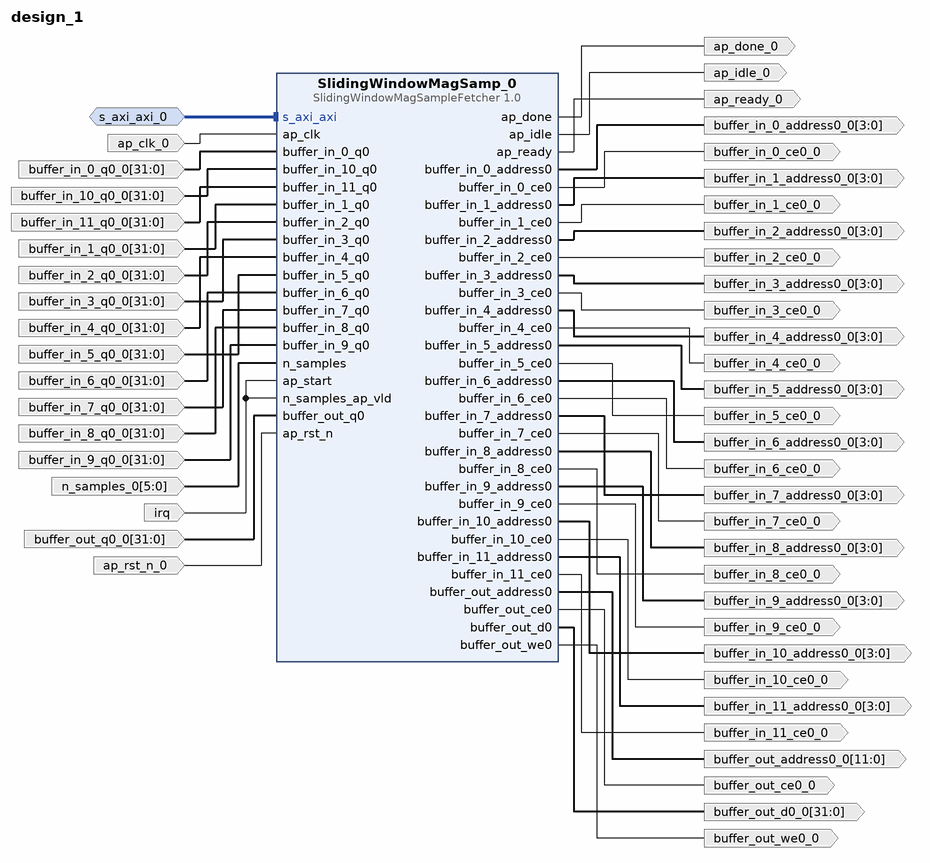
[diagram p0: block diagram of the top level]
# Vivado block design design_1, xczu3eg-sbva484-1-i, Vivado 2020.2
create_bd_design design_1

create_bd_intf_port -mode Slave -vlnv xilinx.com:interface:aximm_rtl:1.0 s_axi_axi_0
set_property -dict [list \
  CONFIG.ADDR_WIDTH 5 \
  CONFIG.ARUSER_WIDTH 0 \
  CONFIG.AWUSER_WIDTH 0 \
  CONFIG.BUSER_WIDTH 0 \
  CONFIG.DATA_WIDTH 32 \
  CONFIG.HAS_BRESP 1 \
  CONFIG.HAS_BURST 0 \
  CONFIG.HAS_CACHE 0 \
  CONFIG.HAS_LOCK 0 \
  CONFIG.HAS_PROT 0 \
  CONFIG.HAS_QOS 0 \
  CONFIG.HAS_REGION 0 \
  CONFIG.HAS_RRESP 1 \
  CONFIG.HAS_WSTRB 1 \
  CONFIG.ID_WIDTH 0 \
  CONFIG.MAX_BURST_LENGTH 1 \
  CONFIG.NUM_READ_OUTSTANDING 1 \
  CONFIG.NUM_READ_THREADS 1 \
  CONFIG.NUM_WRITE_OUTSTANDING 1 \
  CONFIG.NUM_WRITE_THREADS 1 \
  CONFIG.PROTOCOL AXI4LITE \
  CONFIG.READ_WRITE_MODE READ_WRITE \
  CONFIG.RUSER_BITS_PER_BYTE 0 \
  CONFIG.RUSER_WIDTH 0 \
  CONFIG.SUPPORTS_NARROW_BURST 0 \
  CONFIG.WUSER_BITS_PER_BYTE 0 \
  CONFIG.WUSER_WIDTH 0 \
] [get_bd_intf_ports s_axi_axi_0]
create_bd_port -dir I -type clk ap_clk_0
create_bd_port -dir O -from 3 -to 0 -type data buffer_in_0_address0_0
create_bd_port -dir O buffer_in_0_ce0_0
create_bd_port -dir I -from 31 -to 0 -type data buffer_in_0_q0_0
create_bd_port -dir O -from 3 -to 0 -type data buffer_in_10_address0_0
create_bd_port -dir O buffer_in_10_ce0_0
create_bd_port -dir I -from 31 -to 0 -type data buffer_in_10_q0_0
create_bd_port -dir O -from 3 -to 0 -type data buffer_in_11_address0_0
create_bd_port -dir O buffer_in_11_ce0_0
create_bd_port -dir I -from 31 -to 0 -type data buffer_in_11_q0_0
create_bd_port -dir O -from 3 -to 0 -type data buffer_in_1_address0_0
create_bd_port -dir O buffer_in_1_ce0_0
create_bd_port -dir I -from 31 -to 0 -type data buffer_in_1_q0_0
create_bd_port -dir O -from 3 -to 0 -type data buffer_in_2_address0_0
create_bd_port -dir O buffer_in_2_ce0_0
create_bd_port -dir I -from 31 -to 0 -type data buffer_in_2_q0_0
create_bd_port -dir O -from 3 -to 0 -type data buffer_in_3_address0_0
create_bd_port -dir O buffer_in_3_ce0_0
create_bd_port -dir I -from 31 -to 0 -type data buffer_in_3_q0_0
create_bd_port -dir O -from 3 -to 0 -type data buffer_in_4_address0_0
create_bd_port -dir O buffer_in_4_ce0_0
create_bd_port -dir I -from 31 -to 0 -type data buffer_in_4_q0_0
create_bd_port -dir O -from 3 -to 0 -type data buffer_in_5_address0_0
create_bd_port -dir O buffer_in_5_ce0_0
create_bd_port -dir I -from 31 -to 0 -type data buffer_in_5_q0_0
create_bd_port -dir O -from 3 -to 0 -type data buffer_in_6_address0_0
create_bd_port -dir O buffer_in_6_ce0_0
create_bd_port -dir I -from 31 -to 0 -type data buffer_in_6_q0_0
create_bd_port -dir O -from 3 -to 0 -type data buffer_in_7_address0_0
create_bd_port -dir O buffer_in_7_ce0_0
create_bd_port -dir I -from 31 -to 0 -type data buffer_in_7_q0_0
create_bd_port -dir O -from 3 -to 0 -type data buffer_in_8_address0_0
create_bd_port -dir O buffer_in_8_ce0_0
create_bd_port -dir I -from 31 -to 0 -type data buffer_in_8_q0_0
create_bd_port -dir O -from 3 -to 0 -type data buffer_in_9_address0_0
create_bd_port -dir O buffer_in_9_ce0_0
create_bd_port -dir I -from 31 -to 0 -type data buffer_in_9_q0_0
create_bd_port -dir O -from 11 -to 0 -type data buffer_out_address0_0
create_bd_port -dir O buffer_out_ce0_0
create_bd_port -dir O -from 31 -to 0 -type data buffer_out_d0_0
create_bd_port -dir O buffer_out_we0_0
create_bd_port -dir I -from 5 -to 0 -type data n_samples_0
create_bd_port -dir O ap_done_0
create_bd_port -dir O ap_idle_0
create_bd_port -dir O ap_ready_0
create_bd_port -dir I irq
create_bd_port -dir I -from 31 -to 0 -type data buffer_out_q0_0
create_bd_port -dir I -type rst ap_rst_n_0

create_bd_cell -type ip -vlnv DIII:hls:SlidingWindowMagSampleFetcher:1.0 SlidingWindowMagSamp_0

# ---- connections ----

connect_bd_intf_net -intf_net s_axi_axi_0_1 [get_bd_intf_ports s_axi_axi_0] [get_bd_intf_pins SlidingWindowMagSamp_0/s_axi_axi]
connect_bd_net -net ap_clk_0_1 [get_bd_ports ap_clk_0] [get_bd_pins SlidingWindowMagSamp_0/ap_clk]
connect_bd_net [get_bd_pins SlidingWindowMagSamp_0/buffer_in_0_address0] [get_bd_ports buffer_in_0_address0_0]
connect_bd_net [get_bd_pins SlidingWindowMagSamp_0/buffer_in_0_ce0] [get_bd_ports buffer_in_0_ce0_0]
connect_bd_net -net buffer_in_0_q0_0_1 [get_bd_ports buffer_in_0_q0_0] [get_bd_pins SlidingWindowMagSamp_0/buffer_in_0_q0]
connect_bd_net [get_bd_pins SlidingWindowMagSamp_0/buffer_in_10_address0] [get_bd_ports buffer_in_10_address0_0]
connect_bd_net [get_bd_pins SlidingWindowMagSamp_0/buffer_in_10_ce0] [get_bd_ports buffer_in_10_ce0_0]
connect_bd_net -net buffer_in_10_q0_0_1 [get_bd_ports buffer_in_10_q0_0] [get_bd_pins SlidingWindowMagSamp_0/buffer_in_10_q0]
connect_bd_net [get_bd_pins SlidingWindowMagSamp_0/buffer_in_11_address0] [get_bd_ports buffer_in_11_address0_0]
connect_bd_net [get_bd_pins SlidingWindowMagSamp_0/buffer_in_11_ce0] [get_bd_ports buffer_in_11_ce0_0]
connect_bd_net -net buffer_in_11_q0_0_1 [get_bd_ports buffer_in_11_q0_0] [get_bd_pins SlidingWindowMagSamp_0/buffer_in_11_q0]
connect_bd_net [get_bd_pins SlidingWindowMagSamp_0/buffer_in_1_address0] [get_bd_ports buffer_in_1_address0_0]
connect_bd_net [get_bd_pins SlidingWindowMagSamp_0/buffer_in_1_ce0] [get_bd_ports buffer_in_1_ce0_0]
connect_bd_net -net buffer_in_1_q0_0_1 [get_bd_ports buffer_in_1_q0_0] [get_bd_pins SlidingWindowMagSamp_0/buffer_in_1_q0]
connect_bd_net [get_bd_pins SlidingWindowMagSamp_0/buffer_in_2_address0] [get_bd_ports buffer_in_2_address0_0]
connect_bd_net [get_bd_pins SlidingWindowMagSamp_0/buffer_in_2_ce0] [get_bd_ports buffer_in_2_ce0_0]
connect_bd_net -net buffer_in_2_q0_0_1 [get_bd_ports buffer_in_2_q0_0] [get_bd_pins SlidingWindowMagSamp_0/buffer_in_2_q0]
connect_bd_net [get_bd_pins SlidingWindowMagSamp_0/buffer_in_3_address0] [get_bd_ports buffer_in_3_address0_0]
connect_bd_net [get_bd_pins SlidingWindowMagSamp_0/buffer_in_3_ce0] [get_bd_ports buffer_in_3_ce0_0]
connect_bd_net -net buffer_in_3_q0_0_1 [get_bd_ports buffer_in_3_q0_0] [get_bd_pins SlidingWindowMagSamp_0/buffer_in_3_q0]
connect_bd_net [get_bd_pins SlidingWindowMagSamp_0/buffer_in_4_address0] [get_bd_ports buffer_in_4_address0_0]
connect_bd_net [get_bd_pins SlidingWindowMagSamp_0/buffer_in_4_ce0] [get_bd_ports buffer_in_4_ce0_0]
connect_bd_net -net buffer_in_4_q0_0_1 [get_bd_ports buffer_in_4_q0_0] [get_bd_pins SlidingWindowMagSamp_0/buffer_in_4_q0]
connect_bd_net [get_bd_pins SlidingWindowMagSamp_0/buffer_in_5_address0] [get_bd_ports buffer_in_5_address0_0]
connect_bd_net [get_bd_pins SlidingWindowMagSamp_0/buffer_in_5_ce0] [get_bd_ports buffer_in_5_ce0_0]
connect_bd_net -net buffer_in_5_q0_0_1 [get_bd_ports buffer_in_5_q0_0] [get_bd_pins SlidingWindowMagSamp_0/buffer_in_5_q0]
connect_bd_net [get_bd_pins SlidingWindowMagSamp_0/buffer_in_6_address0] [get_bd_ports buffer_in_6_address0_0]
connect_bd_net [get_bd_pins SlidingWindowMagSamp_0/buffer_in_6_ce0] [get_bd_ports buffer_in_6_ce0_0]
connect_bd_net -net buffer_in_6_q0_0_1 [get_bd_ports buffer_in_6_q0_0] [get_bd_pins SlidingWindowMagSamp_0/buffer_in_6_q0]
connect_bd_net [get_bd_pins SlidingWindowMagSamp_0/buffer_in_7_address0] [get_bd_ports buffer_in_7_address0_0]
connect_bd_net [get_bd_pins SlidingWindowMagSamp_0/buffer_in_7_ce0] [get_bd_ports buffer_in_7_ce0_0]
connect_bd_net -net buffer_in_7_q0_0_1 [get_bd_ports buffer_in_7_q0_0] [get_bd_pins SlidingWindowMagSamp_0/buffer_in_7_q0]
connect_bd_net [get_bd_pins SlidingWindowMagSamp_0/buffer_in_8_address0] [get_bd_ports buffer_in_8_address0_0]
connect_bd_net [get_bd_pins SlidingWindowMagSamp_0/buffer_in_8_ce0] [get_bd_ports buffer_in_8_ce0_0]
connect_bd_net -net buffer_in_8_q0_0_1 [get_bd_ports buffer_in_8_q0_0] [get_bd_pins SlidingWindowMagSamp_0/buffer_in_8_q0]
connect_bd_net [get_bd_pins SlidingWindowMagSamp_0/buffer_in_9_address0] [get_bd_ports buffer_in_9_address0_0]
connect_bd_net [get_bd_pins SlidingWindowMagSamp_0/buffer_in_9_ce0] [get_bd_ports buffer_in_9_ce0_0]
connect_bd_net -net buffer_in_9_q0_0_1 [get_bd_ports buffer_in_9_q0_0] [get_bd_pins SlidingWindowMagSamp_0/buffer_in_9_q0]
connect_bd_net [get_bd_pins SlidingWindowMagSamp_0/buffer_out_address0] [get_bd_ports buffer_out_address0_0]
connect_bd_net [get_bd_pins SlidingWindowMagSamp_0/buffer_out_ce0] [get_bd_ports buffer_out_ce0_0]
connect_bd_net [get_bd_pins SlidingWindowMagSamp_0/buffer_out_d0] [get_bd_ports buffer_out_d0_0]
connect_bd_net [get_bd_pins SlidingWindowMagSamp_0/buffer_out_we0] [get_bd_ports buffer_out_we0_0]
connect_bd_net -net n_samples_0_1 [get_bd_ports n_samples_0] [get_bd_pins SlidingWindowMagSamp_0/n_samples]
connect_bd_net [get_bd_pins SlidingWindowMagSamp_0/ap_done] [get_bd_ports ap_done_0]
connect_bd_net [get_bd_pins SlidingWindowMagSamp_0/ap_idle] [get_bd_ports ap_idle_0]
connect_bd_net [get_bd_pins SlidingWindowMagSamp_0/ap_ready] [get_bd_ports ap_ready_0]
connect_bd_net -net n_samples_ap_vld_0_1 [get_bd_ports irq] \
  [get_bd_pins SlidingWindowMagSamp_0/n_samples_ap_vld] [get_bd_pins SlidingWindowMagSamp_0/ap_start]
connect_bd_net -net buffer_out_q0_0_1 [get_bd_ports buffer_out_q0_0] [get_bd_pins SlidingWindowMagSamp_0/buffer_out_q0]
connect_bd_net -net ap_rst_n_0_1 [get_bd_ports ap_rst_n_0] [get_bd_pins SlidingWindowMagSamp_0/ap_rst_n]

validate_bd_design
save_bd_design
